# Altium project MP001-B.PrjPcb
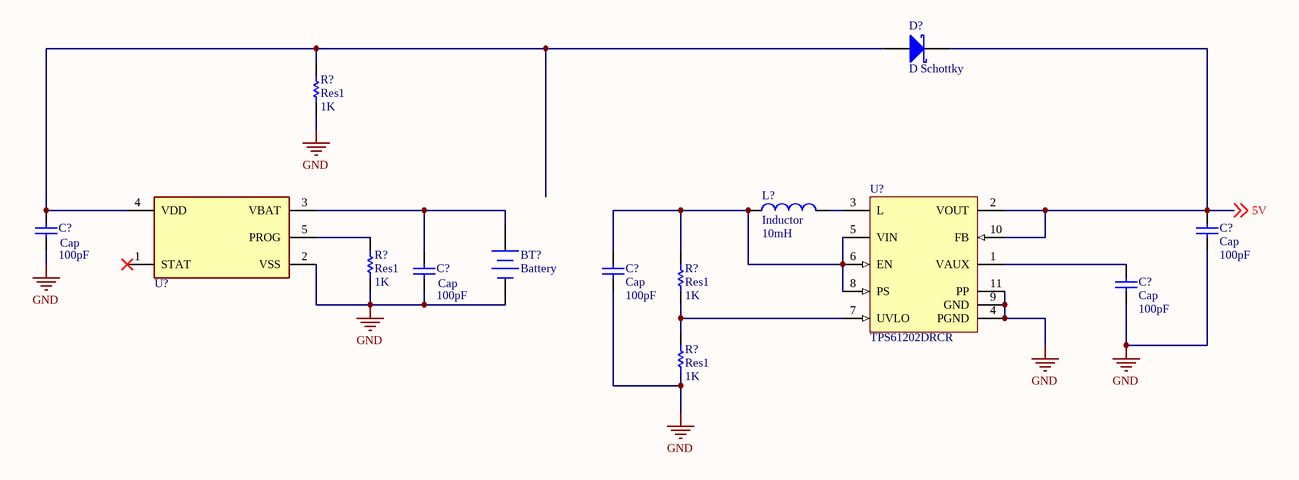
[diagram p0: Battery Management Module.SchDoc]
2 sheets, 34 parts. Net scope: global (net labels, ports and power ports of the same name join across sheets).
Sheets:
  Battery Management Module.SchDoc
  MainArduino.SchDoc

## Sheet Battery Management Module.SchDoc
size A4; SheetNumber: 1; SheetTotal: 2

### Parts
(Parts that share a designator on the sheet are numbered #1, #2 ... from top to bottom, then left to right.)
BT?  Battery  [BAT-2]
C?#1  Cap  value 100pF  [RAD-0.3]
C?#2  Cap  value 100pF  [RAD-0.3]
C?#3  Cap  value 100pF  [RAD-0.3]
C?#4  Cap  value 100pF  [RAD-0.3]
C?#5  Cap  value 100pF  [RAD-0.3]
D?#1  D Schottky  [SMB]
L?  Inductor  value 10mH  [0402-A]
R?#1  Res1  value 1K  [AXIAL-0.3]
R?#2  Res1  value 1K  [AXIAL-0.3]
R?#3  Res1  value 1K  [AXIAL-0.3]
R?#4  Res1  value 1K  [AXIAL-0.3]
U?#1  TPS61202DRCR  [DRC10-2400X1650TP]
U?#2  MCP73831T-2ATI-OT  (value not drawn)

### Nets
5V: C?#1.1 D?#1.2(K) U?#1.2(VOUT) U?#1.10(FB) ; off-sheet 5V
GND: BT?.2(-) C?#1.2 C?#2.1 C?#3.1 C?#4.1 C?#5.2 R?#1.1 R?#2.1 R?#4.1 U?#1.4(PGND) U?#1.9(GND) U?#1.11(PP) U?#2.2(VSS)
NetBT?_1: BT?.1(+) C?#3.2 U?#2.3(VBAT)
NetC?#2_2: C?#2.2 D?#1.1(A) R?#1.2 U?#2.4(VDD)
NetC?#4_2: C?#4.2 L?.1 R?#3.2 U?#1.5(VIN) U?#1.6(EN) U?#1.8(PS)
NetC?#5_1: C?#5.1 U?#1.1(VAUX)
NetL?_2: L?.2 U?#1.3(L)
NetR?#2_2: R?#2.2 U?#2.5(PROG)
NetR?#3_1: R?#3.1 R?#4.2 U?#1.7(UVLO)

Not connected (* = marked no-connect by the designer): U?#2 1(STAT)*

### Library data of the parts
BT? = Battery: Multicell Battery; Published: 24-Mar-1999; LatestRevisionDate: 17-Jul-2002; LatestRevisionNote: Re-released for DXP Platform.; PackageReference: BAT-2; Publisher: Altium Limited; PackageDescription: Battery; 2 Leads
C?#1-C?#5 = Cap: Capacitor; Published: 8-Jun-2000; LatestRevisionDate: 17-Jul-2002; LatestRevisionNote: Re-released for DXP Platform.; PackageReference: RAD-0.3; Publisher: Altium Limited; PackageDescription: Radial Cap, Thru-Hole; 2 Leads; 0.3 in Pin Spacing
D?#1 = D Schottky: Schottky Diode; Published: 8-Jun-2000; LatestRevisionDate: 17-Jul-2002; LatestRevisionNote: Re-released for DXP Platform.; PackageReference: SMB; Publisher: Altium Limited; PackageDescription: DO-214-AA/SMB; 2 C-Bend Leads; Body 5.3 x 3.6 mm, inc. leads (LxW); Code_JEDEC: DO-214-AA
L? = Inductor: Code_IEC: 1005; Published: 8-Jun-2000; LatestRevisionDate: 29-May-2009; LatestRevisionNote: IPC-7351 Footprint Added.; PackageReference: 0402-A; Publisher: Altium Limited; PackageDescription: Chip Inductor; Code_JEITA: 0402
R?#1-R?#4 = Res1: Resistor; Published: 8-Jun-2000; LatestRevisionDate: 17-Jul-2002; LatestRevisionNote: Re-released for DXP Platform.; PackageReference: AXIAL-0.3; Publisher: Altium Limited; PackageDescription: Axial Device, Thru-Hole; 2 Leads; 0.3 in Pin Spacing
U?#1 = TPS61202DRCR: Boost Voltage Converter with 0.3 to 5.5 V Input and 5 V Output, -40 to 85 degC, 10-Pin SON (DRC), Green (RoHS & no Sb/Br); Manufacturer: Texas Instruments; Vout(Min)(V): 5; Vin(Min)(V): 0.3; SubFamily: Step-Up Regulator; Vin(Max)(V): 5.5; Switching Frequency(Max)(kHz): 1250; Synchronous Rectification: TRUE; Regulated Outputs(#): 1; PackageReference: DRC10-2400X1650TP; Preset Vout(V): 5; Eco-Plan: Green (RoHS & no Sb/Br); PartNumber: TPS61202DRCR; ComponentLink1Description: Datasheet; ComponentLink2Description: Package Specification; DatasheetVersion: SLVS577B; ComponentLink1URL: http://www.ti.com/general/docs/lit/getliterature.tsp?genericPartNumber=TPS61202&fileType=pdf; ComponentLink2URL: http://www.ti.com/litv/pdf/mpds117k; Topology: Boost; PackageVersion: revL, Sep-2011; Vout(Max)(V): 5; Mounting Technology: Surface Mount; PackageDescription: 10-Pin Plastic Small Outline No-Lead, 3 x 3 x 1 mm Body, 0.5 mm Pitch, Exposed Pad

## Sheet MainArduino.SchDoc
size A4; SheetNumber: 2; SheetTotal: 2
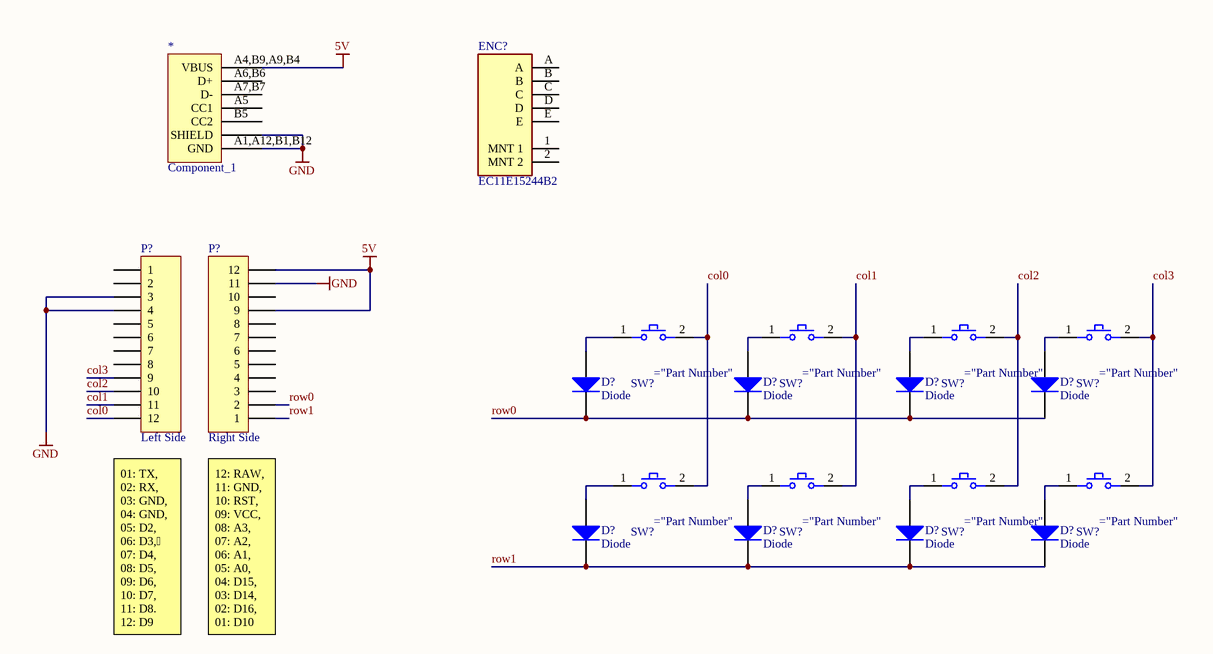
[diagram p1: MainArduino.SchDoc]

### Parts
(Parts that share a designator on the sheet are numbered #1, #2 ... from top to bottom, then left to right.)
*  Component_1
D?#2  Diode  [SMC]
D?#3  Diode  [SMC]
D?#4  Diode  [SMC]
D?#5  Diode  [SMC]
D?#6  Diode  [SMC]
D?#7  Diode  [SMC]
D?#8  Diode  [SMC]
D?#9  Diode  [SMC]
ENC?  Part Number: EC11E15244B2  [ALPS_EC11E15244B2_0]  (hidden comment: Enc_ALPS_EC11E15244B2_eec)
P?#1  Left Side  [HDR1X12]
P?#2  Right Side  [HDR1X12]
SW?#1  MX1A-C1NW  (value not drawn)
SW?#2  MX1A-C1NW  (value not drawn)
SW?#3  MX1A-C1NW  (value not drawn)
SW?#4  MX1A-C1NW  (value not drawn)
SW?#5  MX1A-C1NW  (value not drawn)
SW?#6  MX1A-C1NW  (value not drawn)
SW?#7  MX1A-C1NW  (value not drawn)
SW?#8  MX1A-C1NW  (value not drawn)

### Nets
5V: *.A4,B9,A9,B4(VBUS) P?#2.9 P?#2.12
GND: *.?1(SHIELD) *.A1,A12,B1,B12(GND) P?#1.3 P?#1.4 P?#2.11
col0: P?#1.12 SW?#1.2 SW?#5.2
col1: P?#1.11 SW?#2.2 SW?#6.2
col2: P?#1.10 SW?#3.2 SW?#7.2
col3: P?#1.9 SW?#4.2 SW?#8.2
row0: D?#2.2(K) D?#3.2(K) D?#4.2(K) D?#5.2(K) P?#2.2
row1: D?#6.2(K) D?#7.2(K) D?#8.2(K) D?#9.2(K) P?#2.1
NetD?#2_1: D?#2.1(A) SW?#1.1
NetD?#3_1: D?#3.1(A) SW?#2.1
NetD?#4_1: D?#4.1(A) SW?#3.1
NetD?#5_1: D?#5.1(A) SW?#4.1
NetD?#6_1: D?#6.1(A) SW?#5.1
NetD?#7_1: D?#7.1(A) SW?#6.1
NetD?#8_1: D?#8.1(A) SW?#7.1
NetD?#9_1: D?#9.1(A) SW?#8.1

Not connected (* = marked no-connect by the designer): * A5(CC1) A6,B6(D+) A7,B7(D-) B5(CC2); ENC? 1(MNT_1) 2(MNT_2) A B C D E; P?#1 1 2 5 6 7 8; P?#2 3 4 5 6 7 8 10

### Notes on the sheet
- (near P?#1) 01: TX, 02: RX, 03: GND, 04: GND, 05: D2, 06: D3, 07: D4, 08: D5, 09: D6, 10: D7, 11: D8. 12: D9
- (near P?#2) 12: RAW, 11: GND, 10: RST, 09: VCC, 08: A3, 07: A2, 06: A1, 05: A0, 04: D15, 03: D14, 02: D16, 01: D10

### Library data of the parts
D?#2-D?#9 = Diode: Default Diode; Published: 8-Jun-2000; LatestRevisionDate: 17-Jul-2002; LatestRevisionNote: Re-released for DXP Platform.; PackageVersion: Sep-1996; PackageReference: SMC; Publisher: Altium Limited; PackageDescription: DO-214-AB/SMC; 2 C-Bend Leads; Body 7.9 x 5.9 mm, inc. leads (LxW); Code_JEDEC: DO-214-AB
ENC? = Enc_ALPS_EC11E15244B2_eec: Manufacturer: ALPS; Ratings: 10mA 5V DC; Actuator length: 20mm; Number of pulse: 15; Operating life: 15,000 cycles; Number of detent: 30; helpURL: https://upverter.com/upn/revision/bf96b8ba6cbf8ed0/; ComponentLink2Description: Datasheet; Temperature: -40°C to +85°C; Package: PTH_ENC_11MM7_12MM0; Supplier 2: Mouser; Supplier 1: Digi-Key; ComponentLink1URL: https://upverter.com/upn/revision/bf96b8ba6cbf8ed0/; Supplier Part Number 2: 688-EC11E15244B2; ComponentLink1Description: Upverter; ComponentLink2URL: http://www.alps.com/prod/info/E/HTML/Encoder/Incremental/EC11/EC11E15244B2.html; RoHS: TRUE; Mouser Part Number: 688-EC11E15244B2; Temperature Range High: +85°C; Temperature Range Low: -40°C; Lead Free: yes
P?#1 P?#2 = Header 12: Header, 12-Pin; LatestRevisionDate: 17-Jul-2002; LatestRevisionNote: Re-released for DXP Platform.; Publisher: Altium Limited

## Nets that join several sheets
5V: Battery Management Module (C?#1.1 D?#1.2 U?#1.2 U?#1.10), MainArduino (*.A4,B9,A9,B4 P?#2.9 P?#2.12)
GND: Battery Management Module (13 pins), MainArduino (5 pins)